# Altium schematic sheet MotorDrivers.SchDoc
size A; SheetNumber: 2; SheetTotal: 11
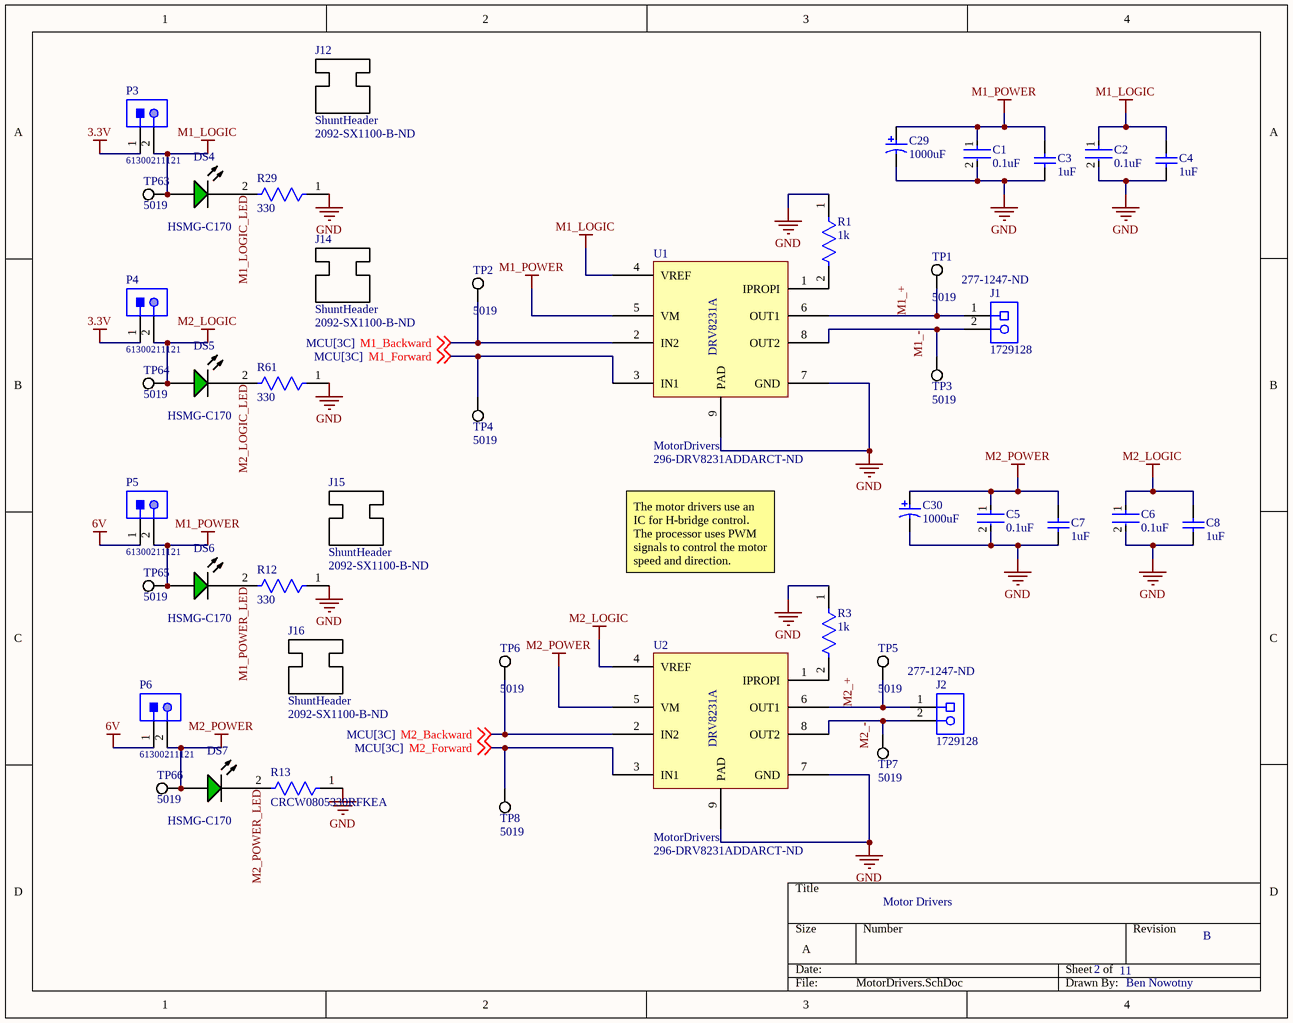
[diagram p0: MotorDrivers.SchDoc]

## Parts
C1  0.1uF  [FP-CC0805-0_85-MFG]
C2  0.1uF  [FP-CC0805-0_85-MFG]
C3  1uF  [CAPC2013X145X50ML20T25]
C4  1uF  [CAPC2013X145X50ML20T25]
C5  0.1uF  [FP-CC0805-0_85-MFG]
C6  0.1uF  [FP-CC0805-0_85-MFG]
C7  1uF  [CAPC2013X145X50ML20T25]
C8  1uF  [CAPC2013X145X50ML20T25]
C29  1000uF  [NIC-CAPA2-10X10_V]
C30  1000uF  [NIC-CAPA2-10X10_V]
DS4  HSMG-C170  [AVAG-HSMX-C170_V]
DS5  HSMG-C170  [AVAG-HSMX-C170_V]
DS6  HSMG-C170  [AVAG-HSMX-C170_V]
DS7  HSMG-C170  [AVAG-HSMX-C170_V]
J1  1729128  Supplier Part Number 1: 277-1247-ND  [PHOE-1729128-2_V]
J2  1729128  Supplier Part Number 1: 277-1247-ND  [PHOE-1729128-2_V]
J12  ShuntHeader  Supplier Part Number 1: 2092-SX1100-B-ND
J14  ShuntHeader  Supplier Part Number 1: 2092-SX1100-B-ND
J15  ShuntHeader  Supplier Part Number 1: 2092-SX1100-B-ND
J16  ShuntHeader  Supplier Part Number 1: 2092-SX1100-B-ND
P3  61300211121  [61300211121]
P4  61300211121  [61300211121]
P5  61300211121  [61300211121]
P6  61300211121  [61300211121]
R1  1k  [FP-ERA6A-IPC_C]
R3  1k  [FP-ERA6A-IPC_C]
R12  330  [FP-CRCW0805-e3-MFG]
R13  CRCW0805330RFKEA  [FP-CRCW0805-e3-MFG]
R29  330  [FP-CRCW0805-e3-MFG]
R61  330  [FP-CRCW0805-e3-MFG]
TP1  5019  [KSTN-5019_V]
TP2  5019  [KSTN-5019_V]
TP3  5019  [KSTN-5019_V]
TP4  5019  [KSTN-5019_V]
TP5  5019  [KSTN-5019_V]
TP6  5019  [KSTN-5019_V]
TP7  5019  [KSTN-5019_V]
TP8  5019  [KSTN-5019_V]
TP63  5019  [KSTN-5019_V]
TP64  5019  [KSTN-5019_V]
TP65  5019  [KSTN-5019_V]
TP66  5019  [KSTN-5019_V]
U1  MotorDrivers  Supplier Part Number 1: 296-DRV8231ADDARCT-ND  [SOIC127P600X170_HS-9N]
U2  MotorDrivers  Supplier Part Number 1: 296-DRV8231ADDARCT-ND  [SOIC127P600X170_HS-9N]

## Nets
3.3V: P3.1 P4.1
6V: P5.1 P6.1
GND: C1.2 C2.2 C3.1 C4.1 C5.2 C6.2 C7.1 C8.1 C29.2 C30.2 R1.1 R3.1 R12.1 R13.1 R29.1 R61.1 U1.7(GND) U1.9(PAD) U2.7(GND) U2.9(PAD)
M1_LOGIC: C2.1 C4.2 DS4.1(A) P3.2 TP63.1 U1.4(VREF)
M1_POWER: C1.1 C3.2 C29.1 DS6.1(A) P5.2 TP65.1 U1.5(VM)
M2_LOGIC: C6.1 C8.2 DS5.1(A) P4.2 TP64.1 U2.4(VREF)
M2_POWER: C5.1 C7.2 C30.1 DS7.1(A) P6.2 TP66.1 U2.5(VM)
M1_+: J1.1 TP1.1 U1.6(OUT1)
M1_-: J1.2 TP3.1 U1.8(OUT2)
M1_Backward: TP2.1 U1.2(IN2) ; off-sheet M1_Backward
M1_Forward: TP4.1 U1.3(IN1) ; off-sheet M1_Forward
M1_LOGIC_LED: DS4.2(K) R29.2
M1_POWER_LED: DS6.2(K) R12.2
M2_+: J2.1 TP5.1 U2.6(OUT1)
M2_-: J2.2 TP7.1 U2.8(OUT2)
M2_Backward: TP6.1 U2.2(IN2) ; off-sheet M2_Backward
M2_Forward: TP8.1 U2.3(IN1) ; off-sheet M2_Forward
M2_LOGIC_LED: DS5.2(K) R61.2
M2_POWER_LED: DS7.2(K) R13.2
NetR1_2: R1.2 U1.1(IPROPI)
NetR3_2: R3.2 U2.1(IPROPI)

## Notes on the sheet
- The motor drivers use an IC for H-bridge control.  The processor uses PWM signals to control the motor speed and direction.
- Motor Drivers
- 11
- B
- Ben Nowotny
- (in symbol MotorDrivers) DRV8231A

## Library data of the parts
C1 C2 C5 C6 = CMP-1036-04410-2: CAP CER 0.1UF 25V X7R 0805; Manufacturer Part Number: CC0805KRX7R8BB104; Manufacturer: Yageo; Tolerance: 0.1; Material: Ceramic; Value: 100 nF; Insulation Resistance: 100GR; ComponentLink2URL: http://www.yageo.com/documents/recent/UPY-GPHC_Y5V_6.3V-to-50V_8.pdf; Category: Cap; Mouser Description: Multilayer Ceramic Capacitors MLCC - SMD/SMT 100nF 25V X7R 10%; Device Class L1: Passive Components; Footprint Url: http://www.yageo.com/exep/pages/download/literatures/UPY-C_GEN_24.pdf; Height: 0.95mm; Digikey Description: CAP CER 0.1UF 25V X7R 0805; Lead Free: Yes; Temperature Range High: +85°C; Temperature: -30°C to +85°C; Ipc Land Pattern Name: CAPC200125X85; Capacitance: 100 nF; Automotive: No; Octopart: https://octopart.com/cc0805krx7r8bb104-yageo-39467766; Device Class L2: Capacitors; Temperature Characteristic: X7R; Voltage Rating: 25 V; ComponentLink2Description: Datasheet; Temperature Range Low: -30°C; Device Class L3: Ceramic Capacitors; RoHS: TRUE; Package: CC0805-0.85; Supplier 1: Digi-Key; Supplier Part Number 1: 311-1141-1-ND; Stock 1: 1013369; Pricing 1: 1=0.11000, 10=0.07700, 50=0.04380, 100=0.03620, 500=0.02542, 1000=0.02104 (USD); Mount: Surface Mount; Case/Package: 0805; Number of Pins: 2; Case Code (Metric): 2012; Case Code (Imperial): 0805; Min Operating Temperature: -55°C; Max Operating Temperature: 125°C; Packaging: Tape and Reel; Voltage Rating (DC): 25V; Dielectric: X7R; Package Quantity: 4000; Termination: SMD/SMT; Series: CC; Resistor Type: Ceramic; Length: 2mm; Width: 1.25mm; Depth: 1.25mm; Thickness: 0.033inch; Radiation Hardening: No; RoHS Compliant: Yes; Reach SVHC Compliant: Yes; Halogen Free: Halogen Free; ComponentLink1URL: https://datasheet.ciiva.com/8034/70765-8034031.pdf?src-supplier=Element14; ComponentLink1Description: https://datasheet.ciiva.com/8034/70765-8034031.pdf?src-supplier=Element14; ComponentLink3URL: https://datasheet.ciiva.com/28450/1489800-28450789.pdf?src-supplier=Element14; ComponentLink3Description: https://datasheet.ciiva.com/28450/1489800-28450789.pdf?src-supplier=Element14; ComponentLink4URL: https://datasheet.ciiva.com/46430/1850775-46430166.pdf?src-supplier=Element14; ComponentLink4Description: https://datasheet.ciiva.com/46430/1850775-46430166.pdf?src-supplier=Element14; ComponentLink5URL: https://datasheet.ciiva.com/145/mlccorderingcode-145008.pdf?src-supplier=Digi-Key; ComponentLink5Description: https://datasheet.ciiva.com/145/mlccorderingcode-145008.pdf?src-supplier=Digi-Key; ComponentLink6URL: https://datasheet.ciiva.com/145/mlccorderingcode-145007.pdf?src-supplier=Digi-Key; ComponentLink6Description: https://datasheet.ciiva.com/145/mlccorderingcode-145007.pdf?src-supplier=Digi-Key; ComponentLink7URL: https://datasheet.ciiva.com/145/mlccorderingcode-145009.pdf?src-supplier=Digi-Key; ComponentLink7Description: https://datasheet.ciiva.com/145/mlccorderingcode-145009.pdf?src-supplier=Digi-Key; ComponentLink8URL: https://datasheet.ciiva.com/8034/1784427-8034030.pdf?src-supplier=Element14; ComponentLink8Description: https://datasheet.ciiva.com/8034/1784427-8034030.pdf?src-supplier=Element14
C3 C4 C7 C8 = CMP-1036-04757-2: Part Number: CC0805ZRY5V8BB105; Manufacturer: Yageo; Voltage Rating: 25V; Tolerance: 80%; Dielectric: Y5V; Supplier 1: Digi-Key; Supplier Part Number 1: 311-1358-1-ND; Manufacturer Part Number: CC0805ZRY5V8BB105; RoHS: Yes; Category: Ceramic Capacitors; Stock 1: 286163; Pricing 1: 1=0.13000, 10=0.09000, 50=0.05100, 100=0.04230, 500=0.02966, 1000=0.02456 (USD); Mount: Surface Mount; Case/Package: 0805; Case Code (Metric): 2012; Case Code (Imperial): 0805; Weight: 0.000194oz; Min Operating Temperature: -30°C; Max Operating Temperature: 85°C; Package Quantity: 1; Capacitance: 1uF; Packaging: Tape and Reel; Voltage Rating (DC): 25V; Termination: SMD/SMT; Series: CC; Resistor Type: Ceramic; Length: 2mm; Width: 1.25mm; Height: 0.85mm; Thickness: 0.033inch; Depth: 1.25mm; Radiation Hardening: No; RoHS Compliant: Yes; Reach SVHC Compliant: Yes; Lead Free: Lead Free; Halogen Free: Halogen Free; ComponentLink1URL: https://datasheet.ciiva.com/144/mlccorderingcode-144703.pdf?src-supplier=Digi-Key; ComponentLink1Description: https://datasheet.ciiva.com/144/mlccorderingcode-144703.pdf?src-supplier=Digi-Key; ComponentLink2URL: https://datasheet.ciiva.com/26863/getdatasheetpartid-419810-26863011.pdf?src-supplier=Verical; ComponentLink2Description: https://datasheet.ciiva.com/26863/getdatasheetpartid-419810-26863011.pdf?src-supplier=Verical; ComponentLink3URL: https://datasheet.ciiva.com/28450/1132289-28450860.pdf?src-supplier=Element14; ComponentLink3Description: https://datasheet.ciiva.com/28450/1132289-28450860.pdf?src-supplier=Element14; ComponentLink4URL: https://datasheet.ciiva.com/144/mlccorderingcode-144704.pdf?src-supplier=Digi-Key; ComponentLink4Description: https://datasheet.ciiva.com/144/mlccorderingcode-144704.pdf?src-supplier=Digi-Key; ComponentLink5URL: https://datasheet.ciiva.com/144/mlccorderingcode-144705.pdf?src-supplier=Digi-Key; ComponentLink5Description: https://datasheet.ciiva.com/144/mlccorderingcode-144705.pdf?src-supplier=Digi-Key; ComponentLink6URL: https://datasheet.ciiva.com/13208/upy-gp-np0-16v-to-50v-8-13208251.pdf?src-supplier=Mouser; ComponentLink6Description: https://datasheet.ciiva.com/13208/upy-gp-np0-16v-to-50v-8-13208251.pdf?src-supplier=Mouser
C29 C30 = CMP-0687-00006-1: Aluminum Electrolytic Capacitor, UD Series, Low Impedance, 1000 uF, 10 V, + / - 20%, -55 to 105 degC, Chip Type, 10 x 10 mm D x L, Pb-Free, Reel; Manufacturer: Nichicon; PartNumber: UUD1A102MNL1GS; Rated Voltage: 10 V; Endurance Time: 5000 h; Impedance: 0.09 Ohm; Packing: Dia382mm Reel; Tolerance Rated Capacitance: -20 to 20%; Rated Ripple Current (at 100kHz): 670 mA; Dielectric Material: Aluminium; Voltage Rating (DC): 10V; Value: 1mF; Ripple Current: 670mA; Leakage Current: 3uA; Life (Hours): 5000Hour; Dissipation Factor: 0.24%; Lead Diameter: 1.1mm; DatasheetVersion: 08/2012; PackageReference: CAPAE-D10H10; PackageDescription: 2-Pin Surface Mount Device, Diameter 10 mm, Height 10 mm, Pitch 8 mm; ComponentLink3URL: http://products.nichicon.co.jp/en/pdf/XJA043/e-ud.pdf; ComponentLink2Description: Datasheet; Diameter: 10 mm; ComponentLink1Description: Manufacturer URL; RoHS: TRUE; ComponentLink2URL: http://products.nichicon.co.jp/en/pdf/XJA043/e-ud.pdf; Length: 10 mm; Rated Capacitance: 1000 uF; ComponentLink1URL: http://www.nichicon.co.jp/; Mounting Technology: Surface Mount; ComponentLink3Description: Package Specification; Supplier 1: Digi-Key; Supplier Part Number 1: 493-2254-1-ND; Manufacturer Part Number: UUD1A102MNL1GS; Category: Aluminum Electrolytic Capacitors; Stock 1: 3265; Pricing 1: 1=0.94000, 10=0.69100, 50=0.55260, 100=0.47360 (USD); Case/Package: Radial; Pins: 2; Min Operating Temperature: -55°C; Max Operating Temperature: 105°C; Tolerance: 20%; Package Quantity: 1; Packaging: Tape and Reel; Voltage Rating: 10V; Termination: SMD/SMT; Voltage: 10V; Series: UD; Construction: Cylindrical; Ripple Current (AC): 670mA; Height: 10mm; Height - Seated (Max): 0.394inch; Lead Pitch: 4.5mm; Radiation Hardening: No; Reach SVHC Compliant: Yes; RoHS Compliant: Yes; Lead Free: Lead Free; ComponentLink4URL: https://datasheet.ciiva.com/11781/0900766b80fa39e7-11781903.pdf?src-supplier=Rs; ComponentLink4Description: https://datasheet.ciiva.com/11781/0900766b80fa39e7-11781903.pdf?src-supplier=Rs; ComponentLink5URL: https://datasheet.ciiva.com/98/e-ud-98263.pdf?src-supplier=Digi-Key; ComponentLink5Description: https://datasheet.ciiva.com/98/e-ud-98263.pdf?src-supplier=Digi-Key; ComponentLink6URL: https://datasheet.ciiva.com/98/e-ud-98264.pdf?src-supplier=Digi-Key; ComponentLink6Description: https://datasheet.ciiva.com/98/e-ud-98264.pdf?src-supplier=Digi-Key; ComponentLink7URL: https://datasheet.ciiva.com/98/e-ud-98265.pdf?src-supplier=Digi-Key; ComponentLink7Description: https://datasheet.ciiva.com/98/e-ud-98265.pdf?src-supplier=Digi-Key; ComponentLink8URL: https://datasheet.ciiva.com/16502/e-ud-16502759.pdf?src-supplier=Future+Electronics; ComponentLink8Description: https://datasheet.ciiva.com/16502/e-ud-16502759.pdf?src-supplier=Future+Electronics; ComponentLink9URL: https://datasheet.ciiva.com/7793/66055-7793131.pdf?src-supplier=Element14; ComponentLink9Description: https://datasheet.ciiva.com/7793/66055-7793131.pdf?src-supplier=Element14; ComponentLink10URL: https://datasheet.ciiva.com/28458/e-ud-28458024.pdf?src-supplier=Element14; ComponentLink10Description: https://datasheet.ciiva.com/28458/e-ud-28458024.pdf?src-supplier=Element14; ComponentLink11URL: https://datasheet.ciiva.com/22693/66055-22693549.pdf?src-supplier=Element14; ComponentLink11Description: https://datasheet.ciiva.com/22693/66055-22693549.pdf?src-supplier=Element14
DS4-DS7 = CMP-2000-05062-1: Chip LED, Green, 2.2 V, -40 to 85 degC, 2-Pin SMD, Pb-Free, Tape and Reel; Manufacturer: Avago; No. of Pins: 2; Peak Wavelength: 570nm; SVHC: NoSVHC(16-Jun-2014); Dominant Wavelength: 572nm; Forward Current If: 20mA; Viewing Angle: 170deg; Lens Shape: Rectangular; PIV Max: 5V; External Width: 1.25mm; LED Type: Standard; External Depth: 0.8mm; Opto Mounting Orientation: Top; Luminous Intensity: 15mcd; Luminous Intensity Min: 4mcd; Forward Voltage VF Max: 2.6V; External Length / Height: 2mm; Bulb Size: 1.25mmx1.4mm; Light Area Height: 1mm; Voltage Vf Typ: 2.2V; Operating Temperature Max: 85degC; Datasheet Version: Oct-08; MSL: MSL2A-4weeks; Peak Forward Current: 20mA; Package Description: 2-Pin Surface Mount Device, Body 2 x 1.25 mm, Height 0.8 mm; Datasheet URL: https://datasheet.ciiva.com/29280/180495-da-01-en-chip-led-hsmg-c170-gelb-gruen-29280971.pdf; Storage Temperature Min: -40degC; LED Colour: Green; Wavelength Typ: 570nm; Mounting Type: SMD; Forward Current If Max: 20mA; Dominant Wavelength Typ: 572nm; LED Mounting: SMD; Operating Temperature Range: -30degCto+85degC; Operating Temperature Min: -30degC; Manufacturer URL: http://www.avagotech.com/; Packaging: CutTape; Luminous Intensity Typ: 15mcd; Package Reference: HSMX-C170; Storage Temperature Max: 85degC; Opto Case Style: SMD; Forward Voltage: 2.2V
J1 J2 = CMP-2000-05815-1: PCB Terminal Block, 13.5 A, 400 V, 2-Pin THD, RoHS, Bulk; Manufacturer: Phoenix Contact; Package Version: 03/2015; No. of Rows: 1; Pitch: 5.08mm; No. of Positions: 2; Voltage Rating: 400V; Current Rating: 13500mA; Current: 10A; Voltage: 300V; Connector Type: Screw; Max Current Rating: 13.5A; Test Voltage: 4kV; Wire Gauge (Max): 26AWG; Wire Gauge (Min): 14AWG; Approvals: UL,CSA; Manufacturer URL: http://www.phoenixcontact.com/; Datasheet URL: https://datasheet.ciiva.com/16046/1729128-16046181.pdf; RoHS: TRUE; Package URL: https://www.phoenixcontact.com/online/portal/pi/pxc/product_detail_page/!ut/p/b1/3VdJjqNKFDxLH8AFycySyWY2ozFsEPOMMQaDOX1XedGL_1Vdm5YXJleknhSKeBkvI6EA8ncAo3AYoDhBQGco6KN7VURTdemj9us_IEKEZo_YHiPAEWEFmDGOHMORkqKYCORBZxgL7ZoaZYcbFFUZ3fqxSY6GOuxydWUuHqz1ynmMFygu583Bob0Ewr6Sd_l-5m-kAueHiB0jpRwZwe58wwtkpxtMYd_LmGcDRU02dRNEyWt6Y2ti5pSyJ_reIkzIulrqApdnbT11V5jnCKbYNCvhEM1MCpPByat_X379-iThf08CI5GfOPqfBeS3BRoBOdD55AKVv0iLwCMq-2BrzXWSGRH7pUGD9uwXQjiph3xL0DKQwdGa0JImiIOmBNOestqgwTHSSs2oOep-78apyXQBvNi8ZLaFjvjWvcaUEBu0MC6Wbe-d6mB0FAebo2lUWinqYaZs5DAYzV0RP9yitUjnGJ0iI9xhZkT42OCQNUJJhkgWINNQLP2JFP6OpMg3JCVg70jqHT0lvKOnhHf0lPuOnnLf0VPuWx6_dxwUIvwk5WMkT0kLL1mh61l2yZVSzG3pYV_bqo-mj6uMKwKwdnnW8Jh5RTOJzMOA5c-eJDaZQw4mTMPH02PvS_ZAqNVjVTo2WyYLkwH_KU1mmmG5kjRhDqPXLwwVHvVOjCM60-fpXvTDfMGW1PVFVS1r4e4yVDk4ZdNbkUHvqPqQSeian4UD39fNKmachqdJ1NJbyk8rXT9mXTvPk3oE5meulKGgiruPJek-4I9hTT6G8ZLOyRSm2RRVbThERQad5OS28hdt4YW4vG0stgYYzsWsK4_7y6DZMjJSCqri1kyiZR5vD7pwIrNR7QwPHTcLTI5qT7eRlpHrdGiupYlqQDJ7zy_CND8fWWBoLRXxk1RVcXiBQwbTD4Xi7KL-FuO94t9xaqweXzH; PartNumber: 1729128; Package Description: 2-Pin Through Hole Device, Body 8.1 x 10.16 mm, Pitch 5.08 mm; Datasheet Version: 12/2013; Mounting Technology: ThroughHole; Orientation: Horizontal; Package Reference: 1729128-2; Packing: Bulk; Supplier 1: Digi-Key; Manufacturer Part Number: 1729128; Category: Terminal Blocks; Stock 1: 23221; Pricing 1: 1=1.32000, 10=1.16200, 50=1.11100, 100=1.08070, 250=1.01000, 500=0.92920, 1000=0.85850, 2500=0.81810, 5000=0.76760 (USD); Pins: 2; Color: Green; Housing Material: Polyamide; Contact Material: Tin; Housing Color: Green; Insulation Material: Nylon; Weight: 0.069842oz; Min Operating Temperature: -20°C; Max Operating Temperature: 100°C; Package Quantity: 50; Packaging: Bulk; Termination: Solder; Number of Positions: 2; Series: MKDSN; Number of Poles: 2; Number of Levels: 1; Number of Positions Per Level: 2; Number of Contacts: 2; Number of Rows: 1; Number of Circuits: 2; Max Supply Voltage: 400V; Length: 8.1mm; Width: 13.5mm; Height: 13.5mm; Wire/Cable Gauge: 26AWG; Depth: 8.1mm; Radiation Hardening: No; RoHS Compliant: Yes; Lead Free: Lead Free; Flammability Rating: UL94 V-0; Reach SVHC Compliant: Yes; ComponentLink1URL: https://datasheet.ciiva.com/16046/1729128-16046181.pdf?src-supplier=Onlinecomponents.com; ComponentLink1Description: https://datasheet.ciiva.com/16046/1729128-16046181.pdf?src-supplier=Onlinecomponents.com; ComponentLink2URL: https://datasheet.ciiva.com/15169/getdatasheetpartid-199310-15169845.pdf?src-supplier=Verical; ComponentLink2Description: https://datasheet.ciiva.com/15169/getdatasheetpartid-199310-15169845.pdf?src-supplier=Verical; ComponentLink3URL: https://datasheet.ciiva.com/823/1729128-823779.pdf?src-supplier=Digi-Key; ComponentLink3Description: https://datasheet.ciiva.com/823/1729128-823779.pdf?src-supplier=Digi-Key; ComponentLink4URL: https://datasheet.ciiva.com/14607/70054405-14607157.pdf?src-supplier=Allied+Electronics; ComponentLink4Description: https://datasheet.ciiva.com/14607/70054405-14607157.pdf?src-supplier=Allied+Electronics; ComponentLink5URL: https://datasheet.ciiva.com/29218/743664-da-01-en-printklemmenblock-mkdsn-1-5-2-5-08-29218154.pdf?src-supplier=Conrad; ComponentLink5Description: https://datasheet.ciiva.com/29218/743664-da-01-en-printklemmenblock-mkdsn-1-5-2-5-08-29218154.pdf?src-supplier=Conrad
J12 J14-J16 = ShuntHeader: Conn Mini Shunt 2 POS 2.54mm Black Cable Mount; Manufacturer: Kycon; Manufacturer Part Number: SX1100-B; Current Rating: 3A; Number of Positions: 2; Insulation Resistance: 1GR; Supplier 1: Digi-Key; RoHS: Yes; Category: Headers and Wire Housings; Stock 1: 85316; Pricing 1: 1=0.10000, 10=0.06000, 25=0.04920, 50=0.04540, 100=0.04390, 250=0.03788, 500=0.03636, 1000=0.03182, 2500=0.02878 (USD); Contact Plating: Gold; Contact Material: Bronze; Housing Material: Thermoplastic; Min Operating Temperature: -55°C; Max Operating Temperature: 125°C; Number of Rows: 1; Contact Gender: Female; Packaging: Bulk; Pitch: 2.54mm; Flammability Rating: UL94 V-0; RoHS Compliant: Yes; ComponentLink1URL: http://www.mouser.com/ds/2/222/SX1100-B-461401.pdf?src-supplier=Mouser; ComponentLink1Description: http://www.mouser.com/ds/2/222/SX1100-B-461401.pdf?src-supplier=Mouser
P3-P6 = CMP-1712-00002-4: THT Vertical Pin Header WR-PHD, Pitch 2.54 mm, Single Row, 2 pins; Manufacturer: Wurth Elektronik; Rated Current: 3A; Gender: Male; Withstanding Voltage: 500VAC; Working Voltage: 250VAC; Pitch: 2.54mm; Contact Resistance: 20mOhm; Pin Number: 2; Voltage Rating: 250V; Connector Type: Male Pin; Mounting Technology: THT; Orientation: Vertical; Operating Temperature: -40to105degC; Packaging: Bag; Publisher: WurthElektronik; Datasheet URL: https://katalog.we-online.de/em/datasheet/6130xx11121.pdf; Manufacturer URL: http://www.we-online.de; Row Number: Single; Package Reference: 61300211121; Part Number: 61300211121; Supplier 1: Digi-Key; Supplier Part Number 1: 732-5315-ND; Manufacturer Part Number: 61300211121; RoHS: Yes; Category: Headers and Wire Housings; Stock 1: 204500; Pricing 1: 1=0.13000, 10=0.11300, 25=0.09400, 50=0.07900, 100=0.07100, 1000=0.06500 (USD); Contact Plating: Gold; Housing Material: PBT; Contact Material: Copper Alloy,Copper; Color: Black; Min Operating Temperature: -40°C; Max Operating Temperature: 125°C; Number of Rows: 1; Contact Gender: Male; Current Rating: 3A; Number of Positions: 2; Termination: Through Hole; Number of Contacts: 2; Series: WR-PHD; Contact Type: Male Pin; Contact Mating Length: 0.236inch; Lead Free: Lead Free; RoHS Compliant: Yes; ComponentLink1URL: https://datasheet.ciiva.com/13619/6130xx11121-48870-13619345.pdf?src-supplier=Mouser; ComponentLink1Description: https://datasheet.ciiva.com/13619/6130xx11121-48870-13619345.pdf?src-supplier=Mouser
R1 R3 = CMP-2001-00581-2: RES 1K OHM 0.1% 1/8W 0805; Temperature Coefficient: 25ppm/°C; Resistance: 1kR; Working Voltage: 100V; Max Power Dissipation: 125mW; Height: 0.5mm; Technology: THIN FILM; REACH SVHC: No SVHC; Packaging: Tape and Reel; Length: 2mm; Width: 1.25mm; Resistance Tolerance: 0.1%; Series: ERA-6A; Resistor Type: Thin Film; Number of Pins: 2; Case Code (Metric): 2012; Voltage Rating: 100V; Radiation Hardening: No; Construction: Rectangular; Mount: Surface Mount; Number of Terminations: 2; Case/Package: 0805; Min Operating Temperature: -55°C; Military Standard: Not; RoHS Compliant: Yes; Termination: SMD/SMT; Case Code (Imperial): 0805; Depth: 1.25mm; Power Rating: 125mW; Max Operating Temperature: 155°C; Contact Plating: Tin; Package Quantity: 5000; Tolerance: 0.1%
R12 R29 R61 = CMP-2001-03823-2: RES Thick Film, 330Ω, 1%, 0.125W, 100ppm/°C, 0805; Manufacturer: Vishay; Manufacturer Part Number: CRCW0805330RFKEA; Voltage Rating (DC): 150V; Resistance: 330R; Max Power Dissipation: 125mW; Mount: Surface Mount; Packaging: Tape and Reel; Min Operating Temperature: -55°C; Military Standard: Not; Case Code (Metric): 2012; Height: 0.02inch; Voltage Rating: 150V; Case/Package: 0805; Max Operating Temperature: 155°C; Width: 0.049inch; Case Code (Imperial): 0805; Termination: SMD/SMT; Lead Free: Lead Free; Contact Plating: Tin; Package Quantity: 10; Composition: Thick Film; Length: 2mm; Features: Automotive AEC-Q200; Depth: 1.25mm; Weight: 0.000194oz; Tolerance: 1%; Power Rating: 125mW; Number of Terminations: 2; Temperature Coefficient: 100ppm/°C; Supplier 1: Digi-Key; Supplier Part Number 1: 541-330CCT-ND; RoHS: Yes; Category: Chip SMD Resistors; Stock 1: 1889; Pricing 1: 1=0.10000, 10=0.06700, 100=0.02710, 1000=0.01219, 2500=0.01058 (USD); Size Code: 0805; Series: CRCW; Resistor Type: Thick Film; Construction: Rectangular; Resistance Tolerance: 1%; Ratings: AEC-Q200; RoHS Compliant: Yes; ComponentLink1URL: https://datasheet.ciiva.com/8944/dcrcwe3-8944773.pdf?src-supplier=Avnet; ComponentLink1Description: https://datasheet.ciiva.com/8944/dcrcwe3-8944773.pdf?src-supplier=Avnet; ComponentLink2URL: https://datasheet.ciiva.com/8944/dcrcwe3-8944776.pdf?src-supplier=Avnet; ComponentLink2Description: https://datasheet.ciiva.com/8944/dcrcwe3-8944776.pdf?src-supplier=Avnet; ComponentLink3URL: https://datasheet.ciiva.com/2495/dcrcwe3-2495803.pdf?src-supplier=Digi-Key; ComponentLink3Description: https://datasheet.ciiva.com/2495/dcrcwe3-2495803.pdf?src-supplier=Digi-Key; ComponentLink4URL: https://datasheet.ciiva.com/2495/dcrcwe3-2495804.pdf?src-supplier=Digi-Key; ComponentLink4Description: https://datasheet.ciiva.com/2495/dcrcwe3-2495804.pdf?src-supplier=Digi-Key; ComponentLink5URL: https://datasheet.ciiva.com/2495/dcrcwe3-2495805.pdf?src-supplier=Digi-Key; ComponentLink5Description: https://datasheet.ciiva.com/2495/dcrcwe3-2495805.pdf?src-supplier=Digi-Key; ComponentLink6URL: https://datasheet.ciiva.com/5545/dcrcwe3-109170-5545357.pdf?src-supplier=Mouser; ComponentLink6Description: https://datasheet.ciiva.com/5545/dcrcwe3-109170-5545357.pdf?src-supplier=Mouser; ComponentLink7URL: https://datasheet.ciiva.com/16769/70201119-16769852.pdf?src-supplier=Allied+Electronics; ComponentLink7Description: https://datasheet.ciiva.com/16769/70201119-16769852.pdf?src-supplier=Allied+Electronics; ComponentLink8URL: https://datasheet.ciiva.com/7777/1697337-7777390.pdf?src-supplier=Element14; ComponentLink8Description: https://datasheet.ciiva.com/7777/1697337-7777390.pdf?src-supplier=Element14; ComponentLink9URL: https://datasheet.ciiva.com/7777/1720486-7777573.pdf?src-supplier=Element14; ComponentLink9Description: https://datasheet.ciiva.com/7777/1720486-7777573.pdf?src-supplier=Element14
R13 = CMP-2001-03823-2: RES Thick Film, 330Ω, 1%, 0.125W, 100ppm/°C, 0805; Voltage Rating (DC): 150V; Resistance: 330R; Max Power Dissipation: 125mW; Mount: Surface Mount; Packaging: Tape and Reel; Min Operating Temperature: -55°C; Military Standard: Not; Case Code (Metric): 2012; Height: 0.02inch; Voltage Rating: 150V; Case/Package: 0805; Max Operating Temperature: 155°C; Width: 0.049inch; Case Code (Imperial): 0805; Termination: SMD/SMT; Lead Free: Lead Free; Contact Plating: Tin; Package Quantity: 10; Composition: Thick Film; Length: 2mm; Features: Automotive AEC-Q200; Depth: 1.25mm; Weight: 0.000194oz; Tolerance: 1%; Power Rating: 125mW; Number of Terminations: 2; Temperature Coefficient: 100ppm/°C
TP1-TP8 TP63-TP66 = CMP-1672-00008-1: Test Point, 1 Position SMD, RoHS, Tape and Reel; Manufacturer: Keystone Electronics; Body Material: Bronze; Plating: Silver; ComponentLink1Description: Manufacturer URL; Package Quantity: 1000; DatasheetVersion: 03/2014; Packaging: Tape and Reel; ComponentLink2URL: http://www.keyelco.com/product-pdf.cfm?p=1357; ComponentLink1URL: http://www.keyelco.com/; Mount: Surface Mount; Contact Plating: Silver; PackageDescription: 1-Pin Surface Mount Device, Body 3.81 x 2.03 mm; Pins: 1; RoHSCompliant: True; Mounting Technology: Surface Mount; ComponentLink2Description: Datasheet; PackageReference: 5019; Supplier 1: Digi-Key; Supplier Part Number 1: 36-5019CT-ND; Manufacturer Part Number: 5019; RoHS: Yes; Category: Connectors; Stock 1: 1009631; Pricing 1: 1=0.34000, 25=0.27360, 100=0.22340, 250=0.20064, 500=0.19152 (USD); Number of Pins: 1; Material: Bronze; Contact Material: Bronze; Series: 5019; Termination: SMD/SMT; Height: 0.09inch; RoHS Compliant: Yes; Reach SVHC Compliant: Yes; Lead Free: Lead Free; ComponentLink3URL: https://datasheet.ciiva.com/16885/70182998-16885945.pdf?src-supplier=Allied+Electronics; ComponentLink3Description: https://datasheet.ciiva.com/16885/70182998-16885945.pdf?src-supplier=Allied+Electronics; ComponentLink4URL: https://datasheet.ciiva.com/14848/m60-2p61-14848437.pdf?src-supplier=Digi-Key; ComponentLink4Description: https://datasheet.ciiva.com/14848/m60-2p61-14848437.pdf?src-supplier=Digi-Key; ComponentLink5URL: https://datasheet.ciiva.com/14848/m60-2p61-14848438.pdf?src-supplier=Digi-Key; ComponentLink5Description: https://datasheet.ciiva.com/14848/m60-2p61-14848438.pdf?src-supplier=Digi-Key; ComponentLink6URL: https://datasheet.ciiva.com/14848/m60-2p61-14848439.pdf?src-supplier=Digi-Key; ComponentLink6Description: https://datasheet.ciiva.com/14848/m60-2p61-14848439.pdf?src-supplier=Digi-Key; ComponentLink7URL: https://datasheet.ciiva.com/16318/m60-2p61-16318395.pdf?src-supplier=Future+Electronics; ComponentLink7Description: https://datasheet.ciiva.com/16318/m60-2p61-16318395.pdf?src-supplier=Future+Electronics
U1 U2 = MotorDrivers: 35-V, 3.7-A H-bridge motor driver with integrated current regulation & current-sense feedback 8-SO PowerPAD -40 to 150; Manufacturer: Texas Instruments; Manufacturer Part Number: DRV8231ADDAR; Supplier 1: Digi-Key; RoHS: No; Category: Integrated Circuits (ICs); Stock 1: 2557; Pricing 1: 1=2.00000, 10=1.79200, 25=1.69080, 100=1.44050, 250=1.35256, 500=1.18348, 1000=0.98061 (USD)